# EAGLE design LogicBoard_ESP_SAMD (EAGLE 7.7.0)
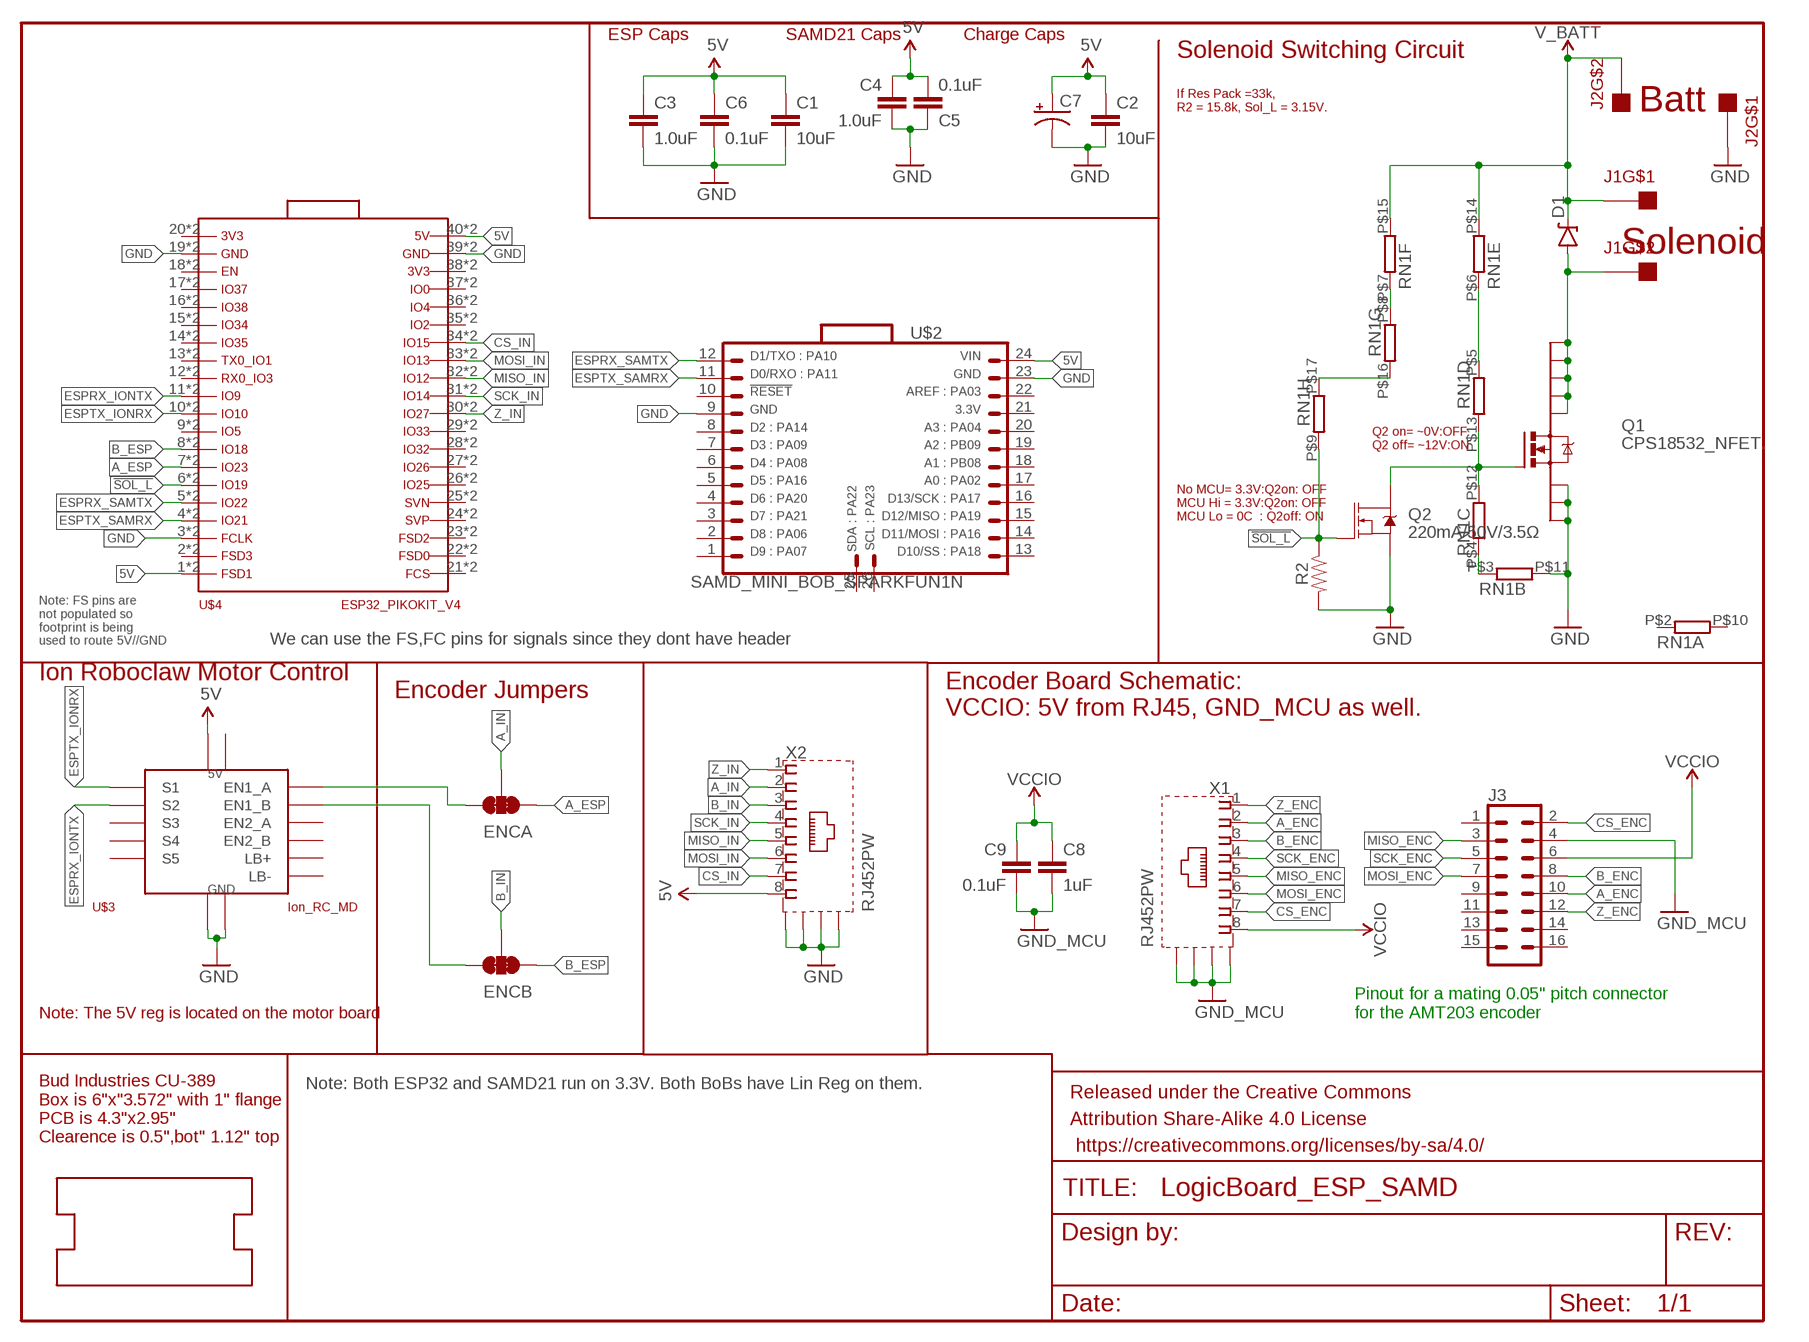
[diagram p0: schematic, sheet 1]

## Parts
C1  10uF  10UF-1206-6.3V-20%  [1206]
C2  10uF  10UF-1206-6.3V-20%  [1206]
C3  1.0uF  1.0UF-0603-16V-10%-X7R  [0603]
C4  1.0uF  1.0UF-0603-16V-10%-X7R  [0603]
C5  0.1uF  0.1UF-0603-25V-5%  [0603]
C6  0.1uF  0.1UF-0603-25V-5%  [0603]
C7  CAP_POLPTH4  [CPOL-RADIAL-1000UF-25V]
C8  1uF  0.1UF-0603-25V-5%  [0603]
C9  0.1uF  0.1UF-0603-25V-5%  [0603]
D1  DIODE-SHOTKEY_SOD-123  [SOD-123_MINI-SMA]
ENCA  JUMPER-SMT_3_2-NC_TRACE_SILK  [SMT-JUMPER_3_2-NC_TRACE_SILK]
ENCB  JUMPER-SMT_3_2-NC_TRACE_SILK  [SMT-JUMPER_3_2-NC_TRACE_SILK]
FRAME1  FRAME-LETTERNO_PACKAGE  [DUMMY]
J1  M2_TERMINAL_0200SPACING  [M2_0200]
J2  M2_TERMINAL_0200SPACING  [M2_0200]
J3  CONN_08X2_1.27MM  [2X08_1.27MM]
Q1  CPS18532_NFET.  [CSD18532_NFET_NEXTFET]
Q2  220mA/50V/3.5Ω  MOSFET-NCH-BSS138  [SOT23-3]
R2  RESISTOR0603  [0603]
RN1  RESISTOR-DIL_8R-N742C163  [RESISTOR-DIL_742C163]
U$1  BOX_BUDIND_CU389STENCIL  [BOX_BUDIND_CU389_STENCIL]
U$2  SAMD_MINI_BOB_SPARKFUN1N  [SAMD_MINI_BOB_SF_NOLABEL]
U$3  ION_ROBOCLAW_MOTORDRVTOPVIEW  [ION_ROBOCLAW_MOTORCNTL]
U$4  ESP32_PICOKIT_V42N  [ESP32_PICOKIT_2N]
X1  RJ452PW  [RJ45-SHIELD1]
X2  RJ452PW  [RJ45-SHIELD1]

## Nets
5V: C1.1 C2.1 C3.1 C4.1 C5.2 C6.1 C7.1(+) U$2.24(VIN) U$3.5V@1(5V) U$3.5V@2(5V) U$3.5V@3(5V) U$3.5V@4(5V) U$3.5V@5(5V) U$4.1 U$4.40 U$4.41 U$4.80 X2.8
!SOL_L!: Q2.1(G) R2.1 RN1.P$9 U$4.6 U$4.46
A_ENC: J3.10 X1.2
A_ESP: ENCA.1 U$4.7 U$4.47
A_IN: ENCA.2 X2.2
B_ENC: J3.8 X1.3
B_ESP: ENCB.1 U$4.8 U$4.48
B_IN: ENCB.2 X2.3
CS_ENC: J3.2 X1.7
CS_IN: U$4.34 U$4.74 X2.7
ESPRX_IONTX: U$3.S2 U$4.11 U$4.51
ESPRX_SAMTX: U$2.12(D1) U$4.5 U$4.45
ESPTX_IONRX: U$3.S1 U$4.10 U$4.50
ESPTX_SAMRX: U$2.11(D0) U$4.4 U$4.44
GND: C1.2 C2.2 C3.2 C4.2 C5.1 C6.2 C7.2(-) J2.P$2 Q1.P$1(S1) Q1.P$2(S2) Q1.P$3(S3) Q2.2(S) R2.2 RN1.P$11 U$2.9(GND) U$2.23(GND) U$3.GND@1(GND) U$3.GND@2(GND) U$3.GND@3(GND) U$3.GND@4(GND) U$3.GND@5(GND) U$3.GND@6(GND) U$3.GND@7(GND) U$4.3 U$4.19 U$4.39 U$4.43 U$4.59 U$4.79 X2.S1(S) X2.S2(S) X2.S3(S) X2.S4(S)
GND_MCU: C8.2 C9.2 J3.4 X1.S1(S) X1.S2(S) X1.S3(S) X1.S4(S)
MISO_ENC: J3.3 X1.5
MISO_IN: U$4.32 U$4.72 X2.5
MOSI_ENC: J3.7 X1.6
MOSI_IN: U$4.33 U$4.73 X2.6
N$1: D1.A J1.P$3 Q1.P$5(D1) Q1.P$6(D2) Q1.P$7(D3) Q1.P$8(D4) Q1.P$9(D_PAD)
N$3: RN1.P$3 RN1.P$4
N$4: Q1.P$4(G) Q2.3(D) RN1.P$12 RN1.P$13
N$5: RN1.P$7 RN1.P$8
N$6: RN1.P$16 RN1.P$17
N$7: RN1.P$5 RN1.P$6
N$8: ENCB.3 U$3.EN1_B
N$10: ENCA.3 U$3.EN1_A
SCK_ENC: J3.5 X1.4
SCK_IN: U$4.31 U$4.71 X2.4
V_BATT: D1.C J1.P$2 J2.P$3 RN1.P$14 RN1.P$15
VCCIO: C8.1 C9.1 J3.6 X1.8
Z_ENC: J3.12 X1.1
Z_IN: U$4.30 U$4.70 X2.1
Unconnected: J3.1 J3.9 J3.11 J3.13 J3.14 J3.15 J3.16 RN1.P$2 RN1.P$10 U$2.1(D9) U$2.2(D8) U$2.3(D7) U$2.4(D6) U$2.5(D5) U$2.6(D4) U$2.7(D3) U$2.8(D2) U$2.10(NRESET) U$2.13(D10) U$2.14(D11) U$2.15(D12) U$2.16(D13) U$2.17(A0) U$2.18(A1) U$2.19(A2) U$2.20(A3) U$2.21(3_3V) U$2.22(AREF) U$2.25(SDA) U$2.26(SCL) U$3.5V@6(5V) U$3.5V@7(5V) U$3.EN2_A U$3.EN2_B U$3.LB+ U$3.LB- U$3.S3 U$3.S4 U$3.S5 U$4.2 U$4.9 U$4.12 U$4.13 U$4.14 U$4.15 U$4.16 U$4.17 U$4.18 U$4.20 U$4.21 U$4.22 U$4.23 U$4.24 U$4.25 U$4.26 U$4.27 U$4.28 U$4.29 U$4.35 U$4.36 U$4.37 U$4.38 U$4.42 U$4.49 U$4.52 U$4.53 U$4.54 U$4.55 U$4.56 U$4.57 U$4.58 U$4.60 U$4.61 U$4.62 U$4.63 U$4.64 U$4.65 U$4.66 U$4.67 U$4.68 U$4.69 U$4.75 U$4.76 U$4.77 U$4.78

## Notes on the sheet
- ESP Caps | SAMD21 Caps | Charge Caps
- Solenoid Switching Circuit
- If Res Pack =33k,
  R2 = 15.8k, Sol_L = 3.15V.
- Batt
- Solenoid
- Q2 on= ~0V:OFF
  Q2 off= ~12V:ON
- No MCU= 3.3V:Q2on: OFF
  MCU Hi = 3.3V:Q2on: OFF
  MCU Lo = 0C  : Q2off: ON
- Note: FS pins are
  not populated so
  footprint is being
  used to route 5V//GND
- We can use the FS,FC pins for signals since they dont have header
- Ion Roboclaw Motor Control
- Encoder Jumpers
- Encoder Board Schematic:
  VCCIO: 5V from RJ45, GND_MCU as well.
- Note: The 5V reg is located on the motor board
- Pinout for a mating 0.05" pitch connector
  for the AMT203 encoder
- Note: Both ESP32 and SAMD21 run on 3.3V. Both BoBs have Lin Reg on them.

## Library data of the parts
C1 C2 = SparkFun-Capacitors:10UF: 10.0µF ceramic capacitors A capacitor is a passive two-terminal electrical component used to store electrical energy temporarily in an electric field.; PROD_ID: CAP-10057
C3 C4 = SparkFun-Capacitors:1.0UF: 1µF ceramic capacitors A capacitor is a passive two-terminal electrical component used to store electrical energy temporarily in an electric field.; PROD_ID: CAP-13930
C5 C6 C9 = SparkFun-Capacitors:0.1UF: 0.1µF ceramic capacitors A capacitor is a passive two-terminal electrical component used to store electrical energy temporarily in an electric field.; PROD_ID: CAP-08604
C7 = !!Pat_030112:CAP_POL: Capacitor Polarized These are standard SMD and PTH capacitors. Normally 10uF, 47uF, and 100uF in electrolytic and tantalum varieties. Always verify the external diameter of the through hole cap, it varies with capacity, voltage, and manufacturer. The EIA devices should be standard.
C8 = SparkFun-Capacitors:0.1UF: 0.1µF ceramic capacitors A capacitor is a passive two-terminal electrical component used to store electrical energy temporarily in an electric field.; PROD_ID: CAP-08604; VALUE: 0.1uF
D1 = !!Pat_030112:DIODE-SHOTKEY_SOD-123
ENCA ENCB = SparkFun-Jumpers:JUMPER-SMT_3_2-NC_TRACE: Normally closed trace jumper (2 of 2 connections) This jumper has a trace between all three pads so they are normally closed (NC). Use a razor knife to open the connection(s). For best results follow the IPC guidelines for cutting traces: Cutout at least 0.063 mm (0.005 in). Remove all loose material to clean up the cut area. Seal the cut with an approved epoxy. Reapply solder to reclose the connection(s).
FRAME1 = SparkFun-Aesthetics:FRAME-LETTER: Schematic Frame - Letter Standard 8.5x11 US Letter frame; DESIGNER: Nobody; VERSION: v01
J1 J2 = !!Pat_030112:M2_TERMINAL_0200SPACING
J3 = !!Pat_030112:CONN_08X2: Multi connection point. Often used as Generic Header-pin footprint for 0.1 inch spaced/style header connections You can populate with any combo of single row headers, but if you'd like an exact match, check this: Header - 2x8 (Male, 0.1") <https://www.sparkfun.com/products/13156> (PRT-13156) On any of the 0.1 inch spaced packages, you can populate with these: Break Away Headers - Straight <https://www.sparkfun.com/products/116> (PRT-00116) Break Away Male Headers - Right Angle <https://www.sparkfun.com/products/553> (PRT-00553) Female Headers <https://www.sparkfun.com/products/115> (PRT-00115) Break Away Headers - Machine Pin <https://www.sparkfun.com/products/117> (PRT-00117) Break Away Female Headers - Swiss Machine Pin <https://www.sparkfun.com/products/743> (PRT-00743)
Q1 = !!Pat_030112:CPS18532_NFET
Q2 = SparkFun-DiscreteSemi:MOSFET-NCH: N-channel MOSFETs Voltage controlled devices that allow control of high current outputs. SparkFun Products: SparkFun OpenScale <https://www.sparkfun.com/products/13261> SparkFun Digital Sandbox <https://www.sparkfun.com/products/12651> SparkFun Monster Moto Shield <https://www.sparkfun.com/products/10182> SparkFun MOSFET Power Controller <https://www.sparkfun.com/products/11214>; PROD_ID: TRANS-00830
R2 = SparkFun-Resistors:RESISTOR: Generic Resistor Package
RN1 = !!Pat_030112:RESISTOR-DIL_8R-N: DIL RESISTOR
U$1 = PW_CH_personal:BOX_BUDIND_CU389
U$2 = !!Pat_030112:SAMD_MINI_BOB_SPARKFUN
U$3 = PW_CH_personal:ION_ROBOCLAW_MOTORDRV
U$4 = PW_CH_personal:ESP32_PICOKIT_V4
X1 X2 = PW_CH_personal:RJ45*2: PAT Modified RJ45 Shield Type 1 For all RJ45 L, LC, LCT and X Series Models Tyco Electronics: 1734795-1

## Board
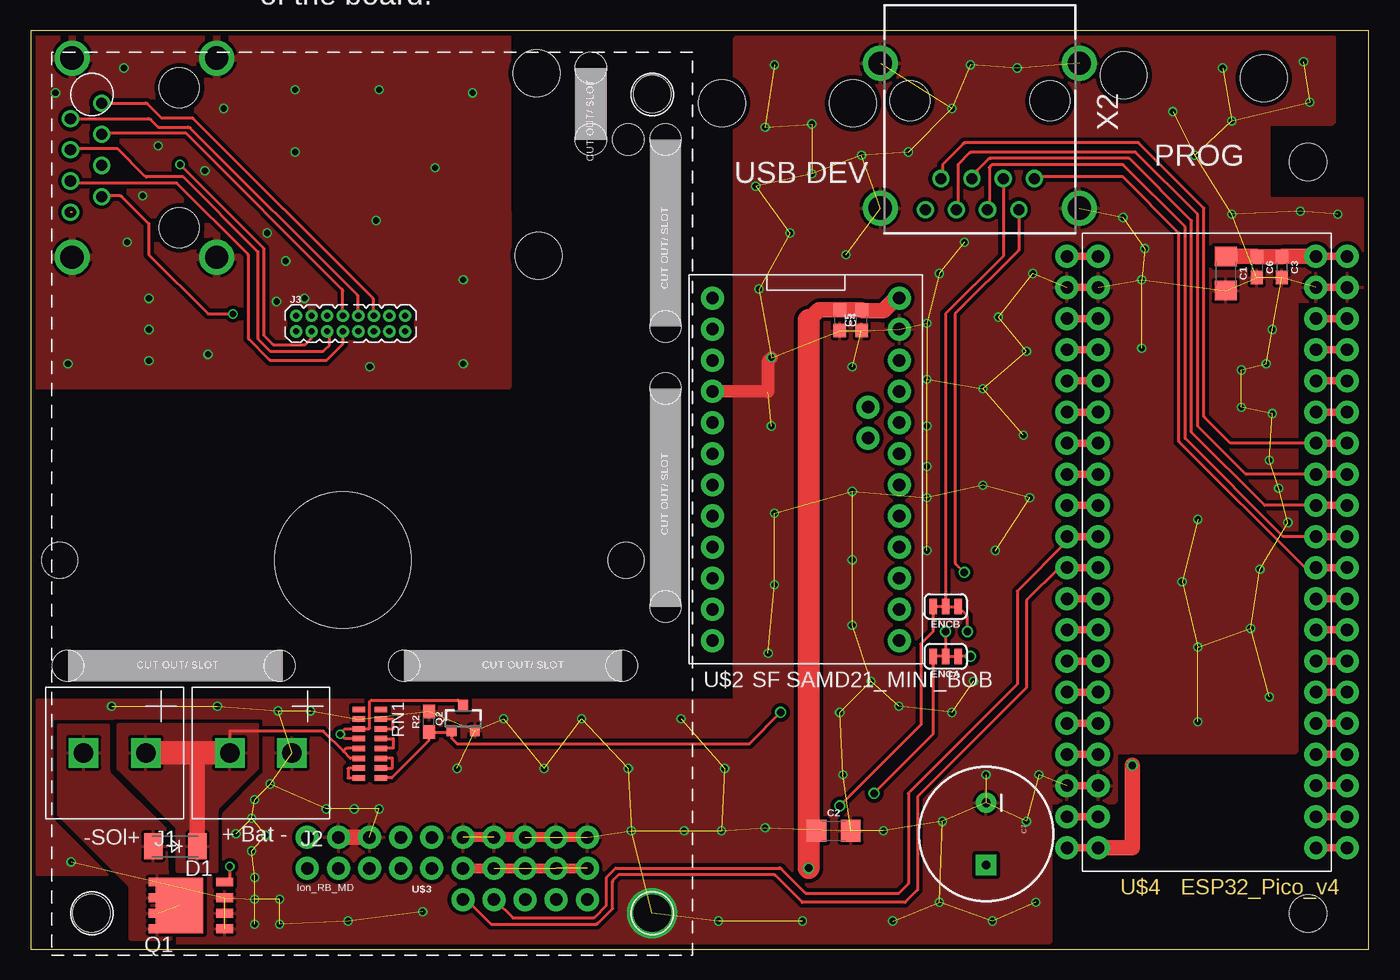
[diagram p1: board, top side]
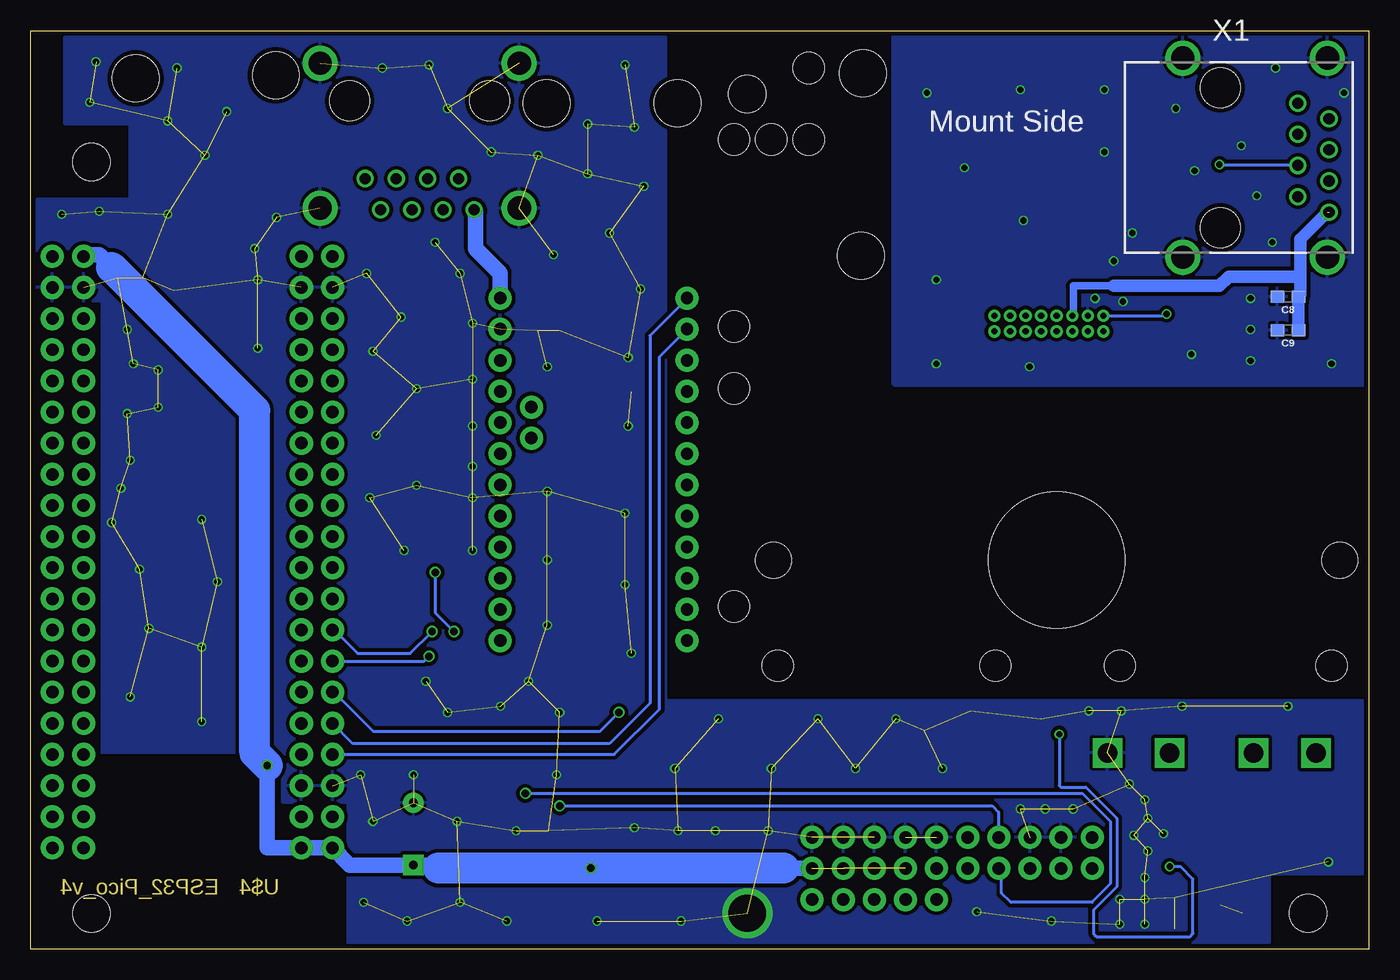
[diagram p2: board, bottom side, seen from below]

Size 109.22 x 74.93 mm. Coordinates in mm from the lower left corner, seen from the top.
Outline: 0,0 109.22,0 109.22,74.93 0,74.93 0,0
Copper layers (1*16): Top 0.035559375mm / dielectric 1.6mm / Bottom 0.035559375mm
Design rules "oshpark-2layer": minimum track width 6mil, minimum drill 10mil, track to track 6mil, track to pad 6mil, pad to pad 6mil, via to via 6mil, smd to smd 6mil, copper to edge 15mil, drill to drill 6mil, minimum pad ring 5mil, minimum via ring 5mil, stop-mask expansion 2.5mil, vias tented up to drill 0mil, thermal gap 10mil
Holes 11.11 mm at 25.48,31.72
Holes 2.92 mm at 48.58,31.72 2.37,31.72
Holes 3.05 mm at 4.95,2.92 50.72,69.75 104.27,64.21 104.24,2.9
Holes 3.81 mm at 41.3,71.45 41.45,56.57 67.11,69.01 100.63,71.04 89.2,71.3 56.44,69.01
Holes 2.54 mm at 3.05,23.11 20.32,23.11 30.48,23.11 48.26,23.11 51.82,27.94 51.82,45.72 51.82,50.8 51.82,66.04 45.72,66.04 45.72,71.88 48.77,66.04

### Footprints (pad centres in the part's own frame; a part is rotated, then mirrored left to right if it is on the bottom)
1206 = smd 1.6 x 1.8: 1 -1.4,0; 2 1.4,0
0603 = smd 1.1 x 1: 1 -0.85,0; 2 0.85,0
CPOL-RADIAL-1000UF-25V = drill 0.7 pad 1.651 square: 1 2.54,0 | drill 0.7 pad 1.651: 2 -2.54,0
SOD-123_MINI-SMA = smd 1.5 x 2.1: A 1.8,0; C -1.8,0
SMT-JUMPER_3_2-NC_TRACE_SILK = smd 0.635 x 1.27: 1 -1.016,0; 2 0,0; 3 1.016,0
M2_0200 = drill 1.6 square: P$2 0,0; P$3 5.08,0
2X08_1.27MM = drill 0.508 pad 1: 1 1.27,1.27; 2 1.27,2.54; 3 2.54,1.27; 4 2.54,2.54; 5 3.81,1.27; 6 3.81,2.54; 7 5.08,1.27; 8 5.08,2.54; 9 6.35,1.27; 10 6.35,2.54; 11 7.62,1.27; 12 7.62,2.54; 13 8.89,1.27; 14 8.89,2.54; 15 10.16,1.27; 16 10.16,2.54
CSD18532_NFET_NEXTFET = smd 1.38 x 0.71: P$1 2.77,-1.905; P$2 2.77,-0.635; P$3 2.77,0.635; P$4 2.77,1.905; P$5 -2.77,1.905; P$6 -2.77,0.635; P$7 -2.77,-0.635; P$8 -2.77,-1.905 | smd 3.85 x 4.52: P$9 -0.941,0
SOT23-3 = smd 0.8 x 0.9: 1 -0.95,-1; 2 0.95,-1; 3 0,1.1
RESISTOR-DIL_742C163 = smd 0.45 x 1: P$2 -2.8,0.9; P$3 -2,0.9; P$4 -1.2,0.9; P$5 -0.4,0.9; P$6 0.4,0.9; P$7 1.2,0.9; P$8 2,0.9; P$9 2.8,0.9; P$10 -2.8,-0.9; P$11 -2,-0.9; P$12 -1.2,-0.9; P$13 -0.4,-0.9; P$14 0.4,-0.9; P$15 1.2,-0.9; P$16 2,-0.9; P$17 2.8,-0.9
SAMD_MINI_BOB_SF_NOLABEL = drill 1.016 pad 1.88: 1 1.905,1.905; 2 1.905,4.445; 3 1.905,6.985; 4 1.905,9.525; 5 1.905,12.065; 6 1.905,14.605; 7 1.905,17.145; 8 1.905,19.685; 9 1.905,22.225; 10 1.905,24.765; 11 1.905,27.305; 12 1.905,29.845; 13 17.145,1.905; 14 17.145,4.445; 15 17.145,6.985; 16 17.145,9.525; 17 17.145,12.065; 18 17.145,14.605; 19 17.145,17.145; 20 17.145,19.685; 21 17.145,22.225; 22 17.145,24.765; 23 17.145,27.305; 24 17.145,29.845; 25 14.605,18.415; 26 14.605,20.955
ION_ROBOCLAW_MOTORCNTL = drill 1.016 pad 1.88: 5V@1 7.087,8.585; 5V@2 7.087,11.125; 5V@3 7.087,13.665; 5V@4 7.087,16.205; 5V@5 7.087,18.745; 5V@6 7.087,26.365; 5V@7 7.087,28.905; EN1_A 7.087,23.825; EN1_B 9.627,23.825; EN2_A 7.087,21.285; EN2_B 9.627,21.285; GND@1 9.627,8.585; GND@2 9.627,11.125; GND@3 9.627,13.665; GND@4 9.627,16.205; GND@5 9.627,18.745; GND@6 9.627,26.365; GND@7 9.627,28.905; LB+ 7.087,31.445; LB- 9.627,31.445; S1 4.547,18.745; S2 4.547,16.205; S3 4.547,13.665; S4 4.547,11.125; S5 4.547,8.585
ESP32_PICOKIT_2N = drill 1.016 pad 1.88: 1 1.27,1.905; 2 1.27,4.445; 3 1.27,6.985; 4 1.27,9.525; 5 1.27,12.065; 6 1.27,14.605; 7 1.27,17.145; 8 1.27,19.685; 9 1.27,22.225; 10 1.27,24.765; 11 1.27,27.305; 12 1.27,29.845; 13 1.27,32.385; 14 1.27,34.925; 15 1.27,37.465; 16 1.27,40.005; 17 1.27,42.545; 18 1.27,45.085; 19 1.27,47.625; 20 1.27,50.165; 21 19.05,1.905; 22 19.05,4.445; 23 19.05,6.985; 24 19.05,9.525; 25 19.05,12.065; 26 19.05,14.605; 27 19.05,17.145; 28 19.05,19.685; 29 19.05,22.225; 30 19.05,24.765; 31 19.05,27.305; 32 19.05,29.845; 33 19.05,32.385; 34 19.05,34.925; 35 19.05,37.465; 36 19.05,40.005; 37 19.05,42.545; 38 19.05,45.085; 39 19.05,47.625; 40 19.05,50.165; 41 -1.27,1.905; 42 -1.27,4.445; 43 -1.27,6.985; 44 -1.27,9.525; 45 -1.27,12.065; 46 -1.27,14.605; 47 -1.27,17.145; 48 -1.27,19.685; 49 -1.27,22.225; 50 -1.27,24.765; 51 -1.27,27.305; 52 -1.27,29.845; 53 -1.27,32.385; 54 -1.27,34.925; 55 -1.27,37.465; 56 -1.27,40.005; 57 -1.27,42.545; 58 -1.27,45.085; 59 -1.27,47.625; 60 -1.27,50.165; 61 21.59,1.905; 62 21.59,4.445; 63 21.59,6.985; 64 21.59,9.525; 65 21.59,12.065; 66 21.59,14.605; 67 21.59,17.145; 68 21.59,19.685; 69 21.59,22.225; 70 21.59,24.765; 71 21.59,27.305; 72 21.59,29.845; 73 21.59,32.385; 74 21.59,34.925; 75 21.59,37.465; 76 21.59,40.005; 77 21.59,42.545; 78 21.59,45.085; 79 21.59,47.625; 80 21.59,50.165
RJ45-SHIELD1 = drill 0.9 pad 1.4: 1 -4.445,6.35; 2 -3.175,8.89; 3 -1.905,6.35; 4 -0.635,8.89; 5 0.635,6.35; 6 1.905,8.89; 7 3.175,6.35; 8 4.445,8.89 | drill 1.9 pad 2.5: S1 -8.128,-3.048; S2 8.128,-3.048; S3 -8.128,8.76; S4 8.128,8.76 | hole 3.251: -5.715,0; 5.715,0

### Placement (x,y rotation side)
C1  97.54,55.12 270 top
C2  65.53,9.65 0 top
C3  102.11,55.63 270 top
C4  66.04,51.31 270 top
C5  67.82,51.31 90 top
C6  100.08,55.63 270 top
C7  77.98,9.4 270 top
C8  6.6,53.21 180 bottom
C9  6.6,50.5 180 bottom
D1  11.81,8.38 180 top
ENCA  74.68,23.88 180 top
ENCB  74.68,27.94 180 top
FRAME1  3.81,82.04 0 top  (outside the outline)
FRAME2  FRAME-LETTERNO_PACKAGE  [DUMMY]  111.02,46.13 0 top
J1  9.4,16 180 top
J2  21.34,16 180 top
J3  20.4,49.12 0 top
Q1  13.08,3.56 0 top
Q2  35.31,18.8 0 top
R2  32.51,18.54 90 top
RN1  27.69,16.76 270 top
U$1  0,0 0 top
U$2  53.75,23.27 0 top
U$3  54.03,-0.51 90 top
U$4  85.85,6.35 0 top
X1  12.14,64.57 270 bottom
X2  77.47,69.22 180 top

### Tracks (layer width: path | path; a pad name or v marks a point on that pad's centre or on a via)
5V  (via drill 0.6)  (3 unrouted)
  Top 0.254: C2.1 64.13,7.24 v63.5,6.6
  Top 1.27: U$4.1 89.92,8.26 v89.92,14.99 | U$2.24 70.64,53.11 69.6,52.07 67.91,52.07 C5.2 C4.1 64.35,52.16 63.5,51.31 | U$4.40 102.15,56.52 C3.1 C6.1 100.03,56.52 C1.1
  Top 1.778: 63.5,51.31 v63.5,6.6
  Bottom 1.27: v89.92,14.99 89.92,8.26 U$4.41 83.19,6.86 C7.1 76.45,6.86 76.45,6.6 75.95,6.6 | U$3.5V@1 47.73,6.58 47.75,6.6 | U$2.24 70.89,55.14 72.9,57.15 72.9,60.2 X2.8 | 102.62,55.63 103.63,56.64 104.78,56.64 U$4.40
  Bottom 2.54: v89.92,14.99 90.93,16 90.93,43.94 102.62,55.63 | 47.75,6.6 v63.5,6.6 75.95,6.6
!SOL_L!  (via drill 0.6)
  Top 0.254: v61.21,19.3 58.67,16.76 34.8,16.76 34.36,17.21 Q2.1 34.25,17.69 R2.1 32.51,17.02 29.46,13.97 RN1.P$9
  Bottom 0.254: U$4.46 83.95,20.95 83.95,20.45 81.28,17.78 62.74,17.78 v61.21,19.3
A_ENC
  Top 0.254: X1.2 9.62,67.74 arc-45 9.8,67.67 10.41,67.06 12.85,67.06 arc-45 13.03,66.98 26.67,53.34 26.67,51.84 arc45 J3.10
A_ESP  (via drill 0.6)
  Top 0.254: v76.71,23.88 ENCA.1
  Bottom 0.254: U$4.47 77.09,23.5 v76.71,23.88
A_IN  (via drill 0.6)
  Top 0.254: X2.2 80.64,57.02 75.44,51.82 75.44,31.5 v76.2,30.73 | v74.68,25.91 ENCA.2
  Bottom 0.254: v76.2,30.73 76.2,27.43 v74.68,25.91
B_ENC
  Top 0.254: J3.8 25.48,53.67 arc45 25.4,53.85 12.7,66.55 5.97,66.55 arc45 X1.3
B_ESP  (via drill 0.6)
  Top 0.254: v76.45,25.91 76.45,27.18 ENCB.1
  Bottom 0.254: U$4.48 84.45,26.04 82.55,24.13 78.23,24.13 v76.45,25.91
B_IN
  Top 0.254: X2.3 79.38,56.52 74.68,51.82 ENCB.2
CS_ENC  (via drill 0.5)
  Top 0.254: X1.7 X1.7 arc-45 5.97,61.47 7.26,61.47 arc-45 7.44,61.39 9.65,59.18 9.65,56.64 14.48,51.82 v16.51,51.82
  Bottom 0.254: J3.2 16.77,51.66 arc-45 16.59,51.74 v16.51,51.82
CS_IN
  Top 0.254: U$4.34 97.92,41.27 95.76,43.43 95.76,60.45 90.42,65.79 76.31,65.79 arc45 76.13,65.71 74.42,64.01 74.42,63.1 arc-45 74.35,62.92 X2.7 74.42,62.99
ESPRX_IONTX
  Top 0.254: U$4.51 84.58,33.27 80.52,29.21 80.52,21.59 71.63,12.7 71.63,5.33 70.87,4.57 63.25,4.57 61.29,6.53 arc45 61.11,6.6 47.75,6.6 46.99,5.84 46.99,3.56 46.05,2.61 arc-45 45.87,2.54 39.37,2.54 37.91,4 arc45 U$3.S2
ESPRX_SAMTX
  Bottom 0.254: U$2.12 55.65,53.06 58.67,50.04 58.67,20.07 61.98,16.76 82.93,16.76 U$4.45
ESPTX_IONRX
  Top 0.254: U$4.50 83.95,31.11 81.28,28.45 81.28,21.34 72.39,12.45 72.39,4.83 71.37,3.81 62.99,3.81 60.78,6.02 arc45 60.6,6.1 48.01,6.1 47.57,5.66 arc45 47.5,5.48 47.5,3.3 46.3,2.11 arc-45 46.12,2.03 37.59,2.03 35.72,3.9 arc45 35.54,3.98 35.31,3.98 arc45 U$3.S1
ESPTX_SAMRX
  Bottom 0.254: U$4.44 61.59,15.88 57.91,19.56 57.91,48.31 U$2.11
GND  (via drill 0.5, 3.05)  (143 unrouted)
  Top 1.016: U$2.9 60.14,45.49 arc-45 60.2,45.47 60.2,47.9 arc-45 60.27,48.08 v60.45,48.26
  Top 1.27: U$3.GND@7 27.62,9.12 arc45 27.69,9.14
  other vias: 48.77,14.73 41.91,14.73 34.8,14.73 56.64,14.73 53.09,18.8 44.96,18.8 38.61,18.8 32,3.05 25.91,2.29 18.29,2.03 18.29,5.84 3.3,7.11 6.6,19.81 15.24,19.81 18.03,10.67 19.56,13.46 24.13,11.43 26.42,11.43 28.45,11.43 49.02,9.65 53.34,9.65 56.39,9.65 59.94,9.91 69.6,9.65 74.42,10.41 81.28,10.41 82.3,14.22 77.98,14.22 75.18,19.3 76.96,21.84 70.87,19.81 68.58,21.84 66.04,19.3 66.29,14.22 67.06,26.42 67.06,31.75 67.06,37.34 60.71,35.56 60.71,29.72 60.2,24.13 60.45,42.67 67.06,47.5 59.44,53.85 66.55,56.64 61.98,58.42 59.18,62.23 63.75,63.25 67.82,64.77 63.75,67.31 59.94,67.06 60.71,72.14 76.71,72.14 75.18,68.58 80.52,71.88 71.63,65.02 76.2,57.66 74.17,55.12 73.15,51.05 73.15,46.48 73.15,42.67 73.15,39.37 73.15,36.83 73.15,32.51 78.74,32.51 81.53,36.83 77.72,37.85 81.03,41.91 81.79,55.12 77.72,45.72 81.28,48.77 78.99,51.56 90.93,57.15 89.15,59.69 90.68,54.61 90.68,49.02 98.81,44.2 98.81,47.24 101.35,50.55 100.84,47.75 101.35,43.69 101.09,39.88 101.85,37.59 102.62,34.8 95.25,35.05 100.33,30.99 93.98,29.97 99.57,26.16 95.25,24.64 101.09,20.57 95.25,18.54 95,64.77 98.04,67.56 103.63,60.2 106.68,59.94 98.04,59.94 104.39,69.09 103.89,72.39 97.28,71.88 93.22,68.33 56.13,2.29 62.99,2.29 70.36,2.29 78.49,2.29 82.04,3.81 74.17,3.81 50.72,2.92 18.29,4.06 18.03,8 18.29,12.19 20.32,2.03 20.32,4.06 19.18,9.27 16.76,9.4 20.19,19.43 22.86,19.43
  pour Top (isolate 0.305, rank 6): 0.51,6.1 7.87,6.1 arc-90 8.13,5.84 8.13,0.51 48.51,0.51 83.06,0.51 arc90 83.31,0.76 83.31,11.94 88.39,11.94 arc90 88.65,12.19 88.65,16 103.12,16 arc90 103.38,16.26 103.38,52.83 108.71,52.83 108.71,61.21 101.35,61.21 arc-90 101.09,61.47 101.09,67.31 106.17,67.31 arc90 106.43,67.56 106.43,74.42 57.66,74.42 arc90 57.4,74.17 57.4,20.32 0.51,20.32
  pour Bottom (isolate 0.305, rank 6): 0.51,20.32 0.51,6.1 8.13,6.1 8.13,0.51 83.31,0.51 83.31,11.94 88.65,11.94 88.65,16 103.38,16 103.38,52.83 108.46,52.83 arc90 108.71,53.09 108.71,61.21 101.09,61.21 101.09,67.31 106.43,67.31 106.43,74.42 57.4,74.42 57.4,20.32
GND_MCU  (via drill 0.5)
  other vias: 3.05,47.75 9.65,53.09 9.65,50.55 22.35,53.09 20.07,52.83 20.83,56.13 19.3,58.42 14.22,63.5 9.14,61.47 10.41,65.53 7.62,71.88 15.75,68.58 2.03,69.85 9.65,48.01 14.48,48.51 27.69,47.5 35.31,47.75 35.31,54.61 28.19,59.44 21.59,65.02 21.59,70.1 28.45,70.1 33.02,63.75 36.07,69.85 7.87,57.66
  pour Top (isolate 0.305): 0.13,45.97 38.96,45.97 38.94,74.4 0.08,74.9
  pour Bottom (isolate 0.305, rank 6): 0,45.97 38.61,45.97 arc90 38.86,46.23 38.86,74.93 0,74.93
MISO_ENC  (via drill 0.5)
  Top 0.254: J3.3 22.94,49.97 arc-45 22.86,49.79 22.35,49.28 19.92,49.28 arc-45 19.74,49.35 19.05,50.04 19.05,57.05 arc45 18.98,57.22 v12.19,64.01
  Bottom 0.254: v12.19,64.01 5.97,64.01 arc45 X1.5
MISO_IN
  Top 0.254: U$4.32 100.71,36.2 94.74,42.16 94.74,59.44 89.66,64.52 78.34,64.52 arc45 78.16,64.44 77.22,63.5 77.22,63.35 arc-45 77.14,63.17 X2.5 76.96,62.99
MOSI_ENC
  Top 0.254: J3.7 25.48,49.46 arc-45 25.4,49.28 24.13,48.01 19.66,48.01 arc-45 19.48,48.08 17.78,49.78 17.78,56.54 arc45 17.71,56.72 11.94,62.48 3.53,62.48 arc-45 3.35,62.56 X1.6
MOSI_IN
  Top 0.254: U$4.33 99.19,38.73 95.25,42.67 95.25,59.94 90.17,65.02 76.81,65.02 arc45 76.63,64.95 75.69,64.01 75.69,60.56 arc-45 75.62,60.38 X2.6 75.69,60.45
N$1  (1 unrouted)
  pour Top: 11.18,1.52 13.97,5.59 11.03,5.59 arc-45 10.85,5.66
  pour Top: 6.35,18.29 6.35,14.58 arc45 6.42,14.4 10.92,9.91 11.43,0.76 8.13,0.76 8.13,4.97 arc45 8.05,5.15 2.29,10.92 2.29,18.29
N$3
  Top 0.254: RN1.P$4 29.6,17.96 29.6,18.75 RN1.P$3
N$4  (via drill 0.5)
  Top 0.254: RN1.P$13 25.64,17.16 v25.27,17.53 25.27,17.6 25.64,17.96 RN1.P$12 | RN1.P$12 | v16.26,6.73 16.26,5.87 Q1.P$4 | RN1.P$12 27.62,17.96 27.69,18.03 27.69,20.19 27.81,20.32 34.88,20.32 Q2.3
  Bottom 0.254: v25.27,17.53 25.27,13.34 25.15,13.21 23.11,13.21 20.57,10.67 20.57,5.08 22.48,3.17 22.48,1.27 22.23,1.02 14.61,1.02 14.35,1.27 14.35,5.71 15.37,6.73 v16.26,6.73
N$5
  Top 0.254: 28.66,15.49 RN1.P$7 28.59,15.58 29.52,15.58 29.52,14.76 RN1.P$8
N$6
  Top 0.254: RN1.P$16 25.94,14.76 25.91,14.73 25.91,13.97 RN1.P$17
N$7
  Top 0.254: RN1.P$5 29.6,17.16 29.6,16.39 28.59,16.39 RN1.P$6
N$8  (via drill 0.6)
  Top 0.254: ENCB.3 73.66,25.91 72.64,24.89 72.64,18.29 v66.04,11.68
  Bottom 0.254: v66.04,11.68 30.73,11.68 30.23,11.18 30.23,9.14 U$3.EN1_B
N$10  (via drill 0.6)
  Top 0.254: ENCA.3 73.66,17.53 v68.83,12.7
  Bottom 0.254: v68.83,12.7 23.37,12.7 21.08,10.41 21.08,5.33 22.61,3.81 29.21,3.81 29.97,4.57 29.97,6.35 U$3.EN1_A
SCK_ENC
  Top 0.254: J3.5 24.31,50.29 arc-45 24.38,50.11 24.38,49.28 23.95,48.84 arc-45 23.77,48.77 19.56,48.77 18.62,49.71 arc-45 18.54,49.89 18.54,56.9 12.45,62.99 9.5,62.99 arc-45 9.32,63.07 7.11,65.28 3.43,65.28 arc45 X1.4
SCK_IN
  Top 0.254: U$4.31 102.23,33.66 94.23,41.66 94.23,58.93 89.15,64.01 78.59,64.01 arc45 78.41,63.93 78.23,63.75 78.23,60.56 arc-45 78.16,60.38 X2.4 78.23,60.45
V_BATT
  Top 0.254: RN1.P$15 26.09,15.56 25.53,16.13 | 25.53,16.13 23.88,17.78 16.26,17.78 J2.P$3 | RN1.P$14 25.76,16.36 25.53,16.13
  Top 1.27: D1.C 13.61,15.9 13.72,16
  Top 1.93: J2.P$3 13.72,16 J1.P$2
  pour Top: 7.11,18.29 7.11,14.84 arc45 7.19,14.66 11.94,9.91 11.94,6.35 15.24,6.35 15.24,11.32 arc-45 15.31,11.5 18.54,14.73 18.54,18.29
VCCIO  (1 unrouted)
  Bottom 0.61: J3.6 24.13,51.74 24.13,54.1 20.83,54.1
  Bottom 1.016: 3.38,60.12 5.59,57.91 5.59,54.86 | 5.59,54.86 5.59,53.38 C8.1 C9.1 | 5.59,54.86 11.43,54.86 12.19,54.1 20.83,54.1
Z_ENC
  Top 0.254: X1.1 9.37,69.01 arc-45 9.55,68.94 10.67,67.82 13.1,67.82 arc-45 13.28,67.74 27.94,53.09 27.94,51.84 arc45 J3.12
Z_IN
  Top 0.254: U$4.30 104.01,31.11 93.73,41.4 93.73,58.42 89.15,62.99 82.15,62.99 arc45 81.97,62.92 X2.1 82.04,62.99

### Text on the board
tPlace: All parts on the back of the board, / the AMT203 is alwo on the back / of the board. | CUT OUT/ SLOT | CUT OUT/ SLOT | CUT OUT/ SLOT | CUT OUT/ SLOT | CUT OUT/ SLOT
tNames: PROG | USB DEV | -SOl+ | + Bat -
bNames: Mount Side